# EAGLE design 5transistor (EAGLE 6.6.0)
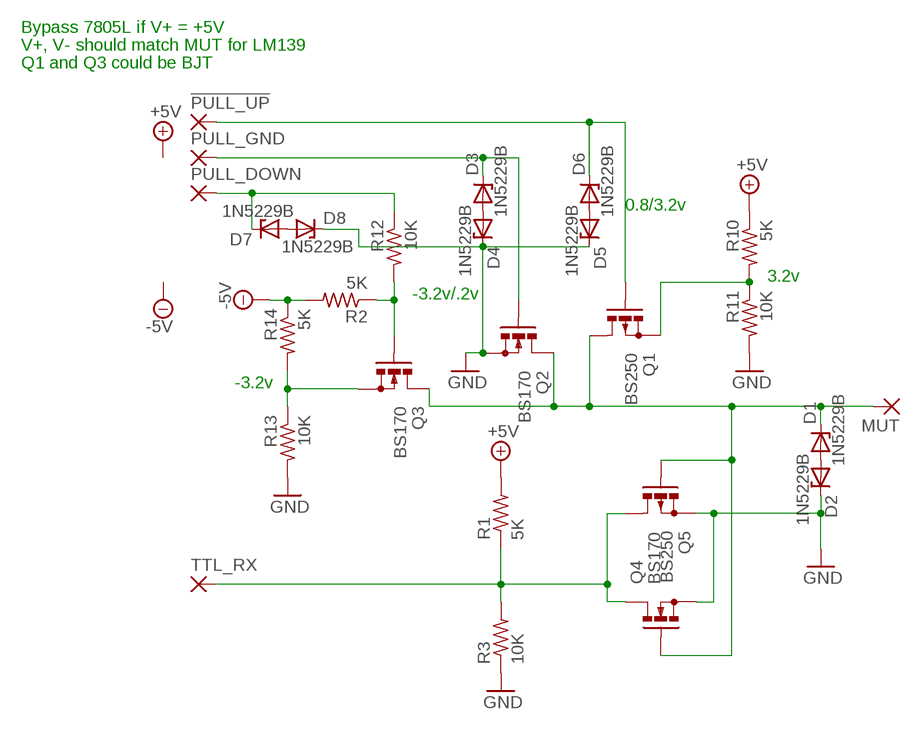
[diagram p0: schematic, sheet 1]

## Parts
!PULL_UP  1,6/0,9  [1,6/0,9]
D1  1N5229B  ZENER-DIODEZD-2.5  [ZDIO-2.5]
D2  1N5229B  ZENER-DIODEZD-2.5  [ZDIO-2.5]
D3  1N5229B  ZENER-DIODEZD-2.5  [ZDIO-2.5]
D4  1N5229B  ZENER-DIODEZD-2.5  [ZDIO-2.5]
D5  1N5229B  ZENER-DIODEZD-2.5  [ZDIO-2.5]
D6  1N5229B  ZENER-DIODEZD-2.5  [ZDIO-2.5]
D7  1N5229B  ZENER-DIODEZD-2.5  [ZDIO-2.5]
D8  1N5229B  ZENER-DIODEZD-2.5  [ZDIO-2.5]
MUT  1,6/0,9  [1,6/0,9]
PULL_DOWN  1,6/0,9  [1,6/0,9]
PULL_GND  1,6/0,9  [1,6/0,9]
Q1  BS250  [SOT54E]
Q2  BS170  [SOT54E]
Q3  BS170  [SOT54E]
Q4  BS170  [SOT54E]
Q5  BS250  [SOT54E]
R1  5K  R-US_0207/2V  [0207/2V]
R2  5K  R-US_0207/2V  [0207/2V]
R3  10K  R-US_0207/2V  [0207/2V]
R10  5K  R-US_0207/2V  [0207/2V]
R11  10K  R-US_0207/2V  [0207/2V]
R12  10K  R-US_0207/2V  [0207/2V]
R13  10K  R-US_0207/2V  [0207/2V]
R14  5K  R-US_0207/2V  [0207/2V]
TTL_RX  1,6/0,9  [1,6/0,9]

## Nets
+5V: R1.2 R10.1
-5V: R2.2 R14.1
GND: D2.C D4.C D5.C D8.C Q2.S Q4.S Q5.S R3.1 R11.2 R13.2
N$1: D1.C MUT.1(P) Q1.D Q2.D Q3.D Q4.G Q5.G
N$2: Q3.G R2.1 R12.2
N$3: D3.C PULL_GND.1(P) Q2.G
N$4: D7.C PULL_DOWN.1(P) R12.1
N$5: Q1.S R10.2 R11.1
N$6: D5.A D6.A
N$7: D1.A D2.A
N$8: Q4.D Q5.D R1.1 R3.2 TTL_RX.1(P)
N$10: !PULL_UP.1(P) D6.C Q1.G
N$11: D3.A D4.A
N$15: D7.A D8.A
N$16: Q3.S R13.1 R14.2

## Notes on the sheet
- Bypass 7805L if V+ = +5V
- V+, V- should match MUT for LM139
- Q1 and Q3 could be BJT
- 0.8/3.2v
- 3.2v
- -3.2v/.2v
- -3.2v

## Library data of the parts
!PULL_UP MUT PULL_DOWN PULL_GND TTL_RX = wirepad:1,6/0,9: THROUGH-HOLE PAD
D1-D8 = diode:ZENER-DIODE: Z-Diode
Q1 Q5 = transistor-small-signal:BS250: P-CHANNEL MOS FET
Q2-Q4 = transistor-small-signal:BS170: N-CHANNEL MOS FET
R1-R3 R10-R14 = rcl:R-US_: RESISTOR, American symbol

## Board
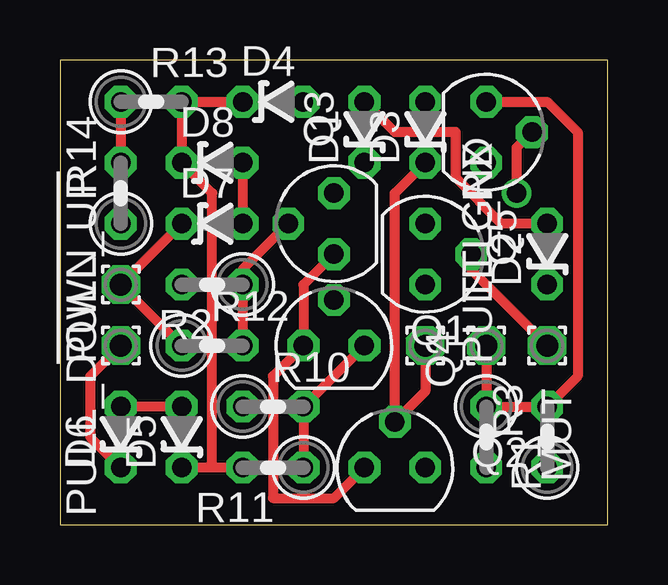
[diagram p1: board, top side]
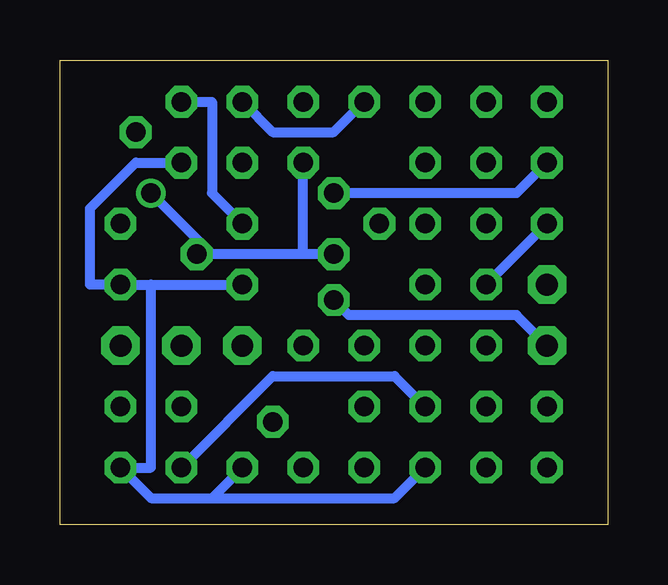
[diagram p2: board, bottom side, seen from below]

Size 22.84 x 19.36 mm. Coordinates in mm from the lower left corner, seen from the top.
Outline: 0,0 22.84,0 22.84,19.36 0,19.36 0,0
Copper layers (1+16): Top 0.035mm / dielectric 1.5mm / Bottom 0.035mm
Design rules "16mils": minimum track width 16mil, minimum drill 32mil, track to track 15mil, track to pad 10mil, pad to pad 10mil, via to via 10mil, smd to smd 10mil, copper to edge 13mil, drill to drill 10mil, minimum pad ring 10mil, minimum via ring 8mil, stop-mask expansion 0mil, vias tented up to drill 0mil, thermal gap 10mil

### Footprints (pad centres in the part's own frame; a part is rotated, then mirrored left to right if it is on the bottom)
1,6/0,9 = drill 0.914 pad 1.6 octagon: 1 0,0
ZDIO-2.5 = drill 0.813 octagon: A 1.27,0; C -1.27,0
SOT54E = drill 0.813 octagon: D -1.27,0; G 0,1.905; S 1.27,0
0207/2V = drill 0.813 octagon: 1 -1.27,0; 2 1.27,0

### Placement (x,y rotation side)
!PULL_UP  2.54,7.46 90 top
D1  12.69,16.35 90 top
D2  20.32,11.27 90 top
D3  15.23,16.35 90 top
D4  8.88,17.62 0 top
D5  5.08,3.65 90 top
D6  2.54,3.65 90 top
D7  6.34,12.54 0 top
D8  6.34,15.08 0 top
MUT  20.32,7.46 270 top
PULL_DOWN  2.54,10 270 top
PULL_GND  15.23,7.46 0 top
Q1  11.42,7.46 0 top
Q2  13.96,2.38 0 top
Q3  11.42,12.54 90 top
Q4  15.23,11.27 270 top
Q5  17.78,16.35 270 top
R1  17.78,3.65 270 top
R2  6.34,10 180 top
R3  20.32,3.65 90 top
R10  8.88,4.92 0 top
R11  8.88,2.38 180 top
R12  6.34,7.46 0 top
R13  3.81,17.62 0 top
R14  2.54,13.81 90 top
TTL_RX  17.78,7.46 90 top

### Tracks (layer width: path | path; a pad name or v marks a point on that pad's centre or on a via)
+5V
  Bottom 0.406: R10.1 8.88,6.18 13.96,6.18 R1.2
-5V
  Bottom 0.406: R2.2 R14.1
GND
  Top 0.406: D4.C R13.2 D8.C 6.34,13.81 6.34,2.38 | R11.2 6.34,2.38 | 6.34,2.38 D5.C
  Bottom 0.406: 19.05,10 D2.C 21.59,10 21.59,13.17 19.68,15.08 Q5.S | 19.05,10 Q4.S | 16.51,1.1 Q2.S | 16.51,1.1 19.05,1.1 R3.1 19.05,2.38 19.05,10 | R11.2 8.88,1.1 16.51,1.1
N$1  (via drill 0.81)
  Top 0.406: Q3.D 10.15,10 Q1.D 8.88,6.18 8.88,1.1 11.42,1.1 Q2.D | Q5.G 19.05,15.71 v19.05,13.81 | MUT.1 17.14,10.63 Q4.G
  Bottom 0.406: 12.69,11.27 D1.C | Q3.D 12.69,11.27 | 12.69,11.27 16.51,11.27 | 16.51,11.27 v19.05,13.81 | 16.51,11.27 Q4.G
N$2
  Top 0.406: R12.2 R2.1 7.62,10.63 Q3.G
N$3
  Top 0.406: PULL_GND.1 15.23,5.55 Q2.G 13.96,13.81 D3.C
N$4
  Top 0.406: R12.1 PULL_DOWN.1 D7.C
N$5
  Top 0.406: R11.1 R10.2 Q1.S
N$6
  Top 0.406: D5.A D6.A
N$7
  Top 0.406: D1.A 13.96,16.35 16.51,16.35 16.51,14.44 18.41,12.54 D2.A
N$8
  Top 0.406: TTL_RX.1 R1.1 R3.2 21.59,6.18 21.59,16.35 20.32,17.62 Q5.D
  Bottom 0.406: Q4.D 16.51,13.81 16.51,17.62 Q5.D
N$10
  Top 0.406: D6.C 1.27,3.65 1.27,6.18 !PULL_UP.1
  Bottom 0.406: Q1.G 10.79,8.73 3.81,8.73 !PULL_UP.1
N$11
  Bottom 0.406: D4.A 11.42,16.35 13.96,16.35 D3.A
N$15
  Top 0.406: D8.A D7.A
N$16
  Top 0.406: R13.1 R14.2
  Bottom 0.406: Q3.S 3.81,13.81 R14.2